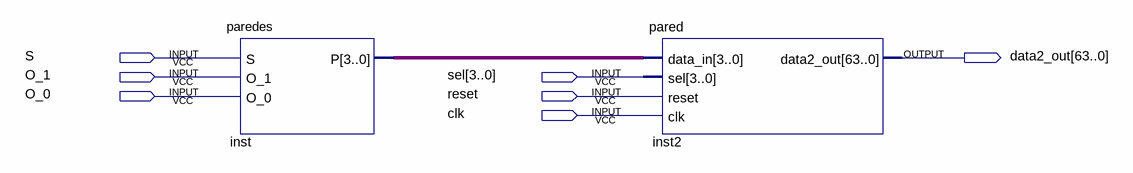
[diagram p0: schematic sheet]
// Quartus schematic pruebaparedes.bdf as structural Verilog: 2 symbols, 7 pins
module pruebaparedes (
  input  S,
  input  O_1,
  input  [3:0] sel,
  input  O_0,
  input  reset,
  input  clk,
  output [63:0] data2_out
);

  wire [3:0] inst_p;

  paredes inst (.S(S), .O_1(O_1), .O_0(O_0), .P(inst_p));
  pared inst2 (.data_in(inst_p), .sel(sel), .reset(reset), .clk(clk), .data2_out(data2_out));
endmodule
